# Altium project 28335_BASIC.PrjPcb
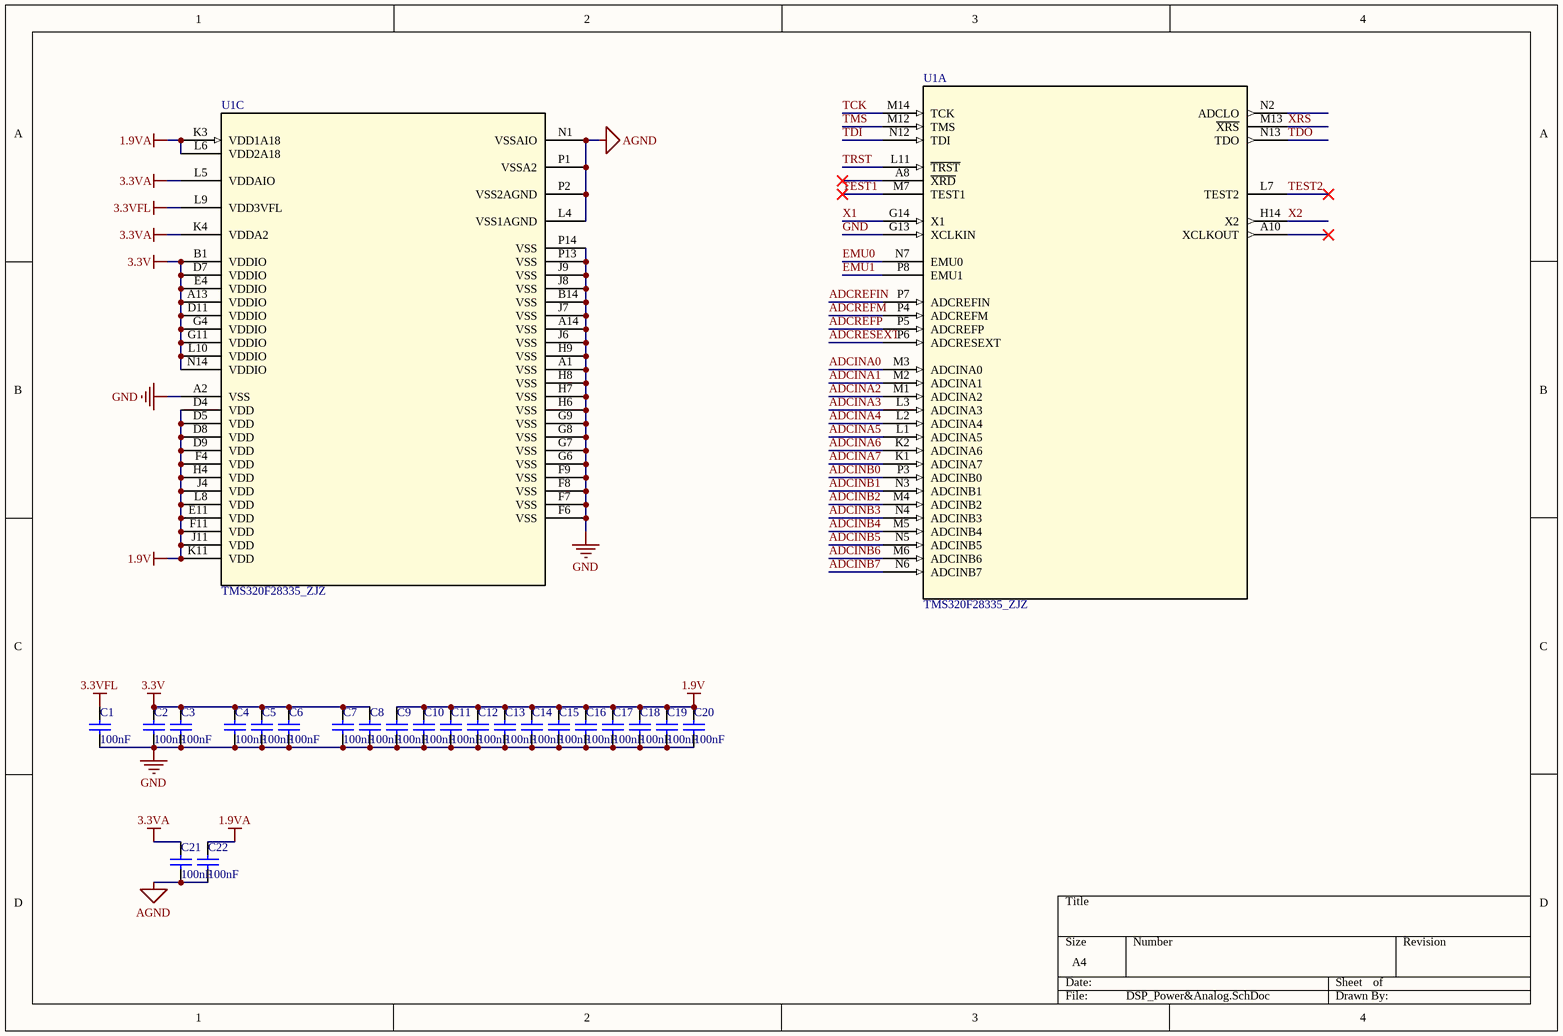
[diagram p0: DSP_Power&Analog.SchDoc]
3 sheets, 73 parts. Net scope: global (net labels, ports and power ports of the same name join across sheets).
Board file: PCB.PcbDoc
Sheets:
  DSP_Power&Analog.SchDoc
  DSP_GPIO&Digital.SchDoc
  DSP_Header.SchDoc

## Sheet DSP_Power&Analog.SchDoc
size A4

### Parts
C1  value 100nF  [C0402]  (hidden comment: Cap)
C2  value 100nF  [C0402]  (hidden comment: Cap)
C3  value 100nF  [C0402]  (hidden comment: Cap)
C4  value 100nF  [C0402]  (hidden comment: Cap)
C5  value 100nF  [C0402]  (hidden comment: Cap)
C6  value 100nF  [C0402]  (hidden comment: Cap)
C7  value 100nF  [C0603]  (hidden comment: Cap)
C8  value 100nF  [C0603]  (hidden comment: Cap)
C9  value 100nF  [C0402]  (hidden comment: Cap)
C10  value 100nF  [C0402]  (hidden comment: Cap)
C11  value 100nF  [C0402]  (hidden comment: Cap)
C12  value 100nF  [C0402]  (hidden comment: Cap)
C13  value 100nF  [C0402]  (hidden comment: Cap)
C14  value 100nF  [C0402]  (hidden comment: Cap)
C15  value 100nF  [C0402]  (hidden comment: Cap)
C16  value 100nF  [C0402]  (hidden comment: Cap)
C17  value 100nF  [C0402]  (hidden comment: Cap)
C18  value 100nF  [C0402]  (hidden comment: Cap)
C19  value 100nF  [C0402]  (hidden comment: Cap)
C20  value 100nF  [C0402]  (hidden comment: Cap)
C21  value 100nF  [C0402]  (hidden comment: Cap)
C22  value 100nF  [C0402]  (hidden comment: Cap)
U1  TMS320F28335_ZJZ  [ZJZ176]  (parts A,C of 3)

### Nets
1.9V: C9.1 C10.1 C11.1 C12.1 C13.1 C14.1 C15.1 C16.1 C17.1 C18.1 C19.1 C20.1 U1.D4(VDD) U1.D5(VDD) U1.D8(VDD) U1.D9(VDD) U1.E11(VDD) U1.F4(VDD) U1.F11(VDD) U1.H4(VDD) U1.J4(VDD) U1.J11(VDD) U1.K11(VDD) U1.L8(VDD)
1.9VA: C22.1 U1.K3(VDD1A18) U1.L6(VDD2A18)
3.3V: C2.1 C3.1 C4.1 C5.1 C6.1 C7.1 C8.1 U1.A13(VDDIO) U1.B1(VDDIO) U1.D7(VDDIO) U1.D11(VDDIO) U1.E4(VDDIO) U1.G4(VDDIO) U1.G11(VDDIO) U1.L10(VDDIO) U1.N14(VDDIO)
3.3VA: C21.1 U1.K4(VDDA2) U1.L5(VDDAIO)
3.3VFL: C1.1 U1.L9(VDD3VFL)
AGND: C21.2 C22.2 U1.L4(VSS1AGND) U1.N1(VSSAIO) U1.P1(VSSA2) U1.P2(VSS2AGND)
GND: C1.2 C2.2 C3.2 C4.2 C5.2 C6.2 C7.2 C8.2 C9.2 C10.2 C11.2 C12.2 C13.2 C14.2 C15.2 C16.2 C17.2 C18.2 C19.2 C20.2 U1.A1(VSS) U1.A2(VSS) U1.A14(VSS) U1.B14(VSS) U1.F6(VSS) U1.F7(VSS) U1.F8(VSS) U1.F9(VSS) U1.G6(VSS) U1.G7(VSS) U1.G8(VSS) U1.G9(VSS) U1.G13(XCLKIN) U1.H6(VSS) U1.H7(VSS) U1.H8(VSS) U1.H9(VSS) U1.J6(VSS) U1.J7(VSS) U1.J8(VSS) U1.J9(VSS) U1.P13(VSS) U1.P14(VSS)
ADCINA0: U1.M3(ADCINA0)
ADCINA1: U1.M2(ADCINA1)
ADCINA2: U1.M1(ADCINA2)
ADCINA3: U1.L3(ADCINA3)
ADCINA4: U1.L2(ADCINA4)
ADCINA5: U1.L1(ADCINA5)
ADCINA6: U1.K2(ADCINA6)
ADCINA7: U1.K1(ADCINA7)
ADCINB0: U1.P3(ADCINB0)
ADCINB1: U1.N3(ADCINB1)
ADCINB2: U1.M4(ADCINB2)
ADCINB3: U1.N4(ADCINB3)
ADCINB4: U1.M5(ADCINB4)
ADCINB5: U1.N5(ADCINB5)
ADCINB6: U1.M6(ADCINB6)
ADCINB7: U1.N6(ADCINB7)
ADCREFIN: U1.P7(ADCREFIN)
ADCREFM: U1.P4(ADCREFM)
ADCREFP: U1.P5(ADCREFP)
ADCRESEXT: U1.P6(ADCRESEXT)
EMU0: U1.N7(EMU0)
EMU1: U1.P8(EMU1)
TCK: U1.M14(TCK)
TDI: U1.N12(TDI)
TDO: U1.N13(TDO)
TEST1: U1.M7(TEST1)
TEST2: U1.L7(TEST2)
TMS: U1.M12(TMS)
TRST: U1.L11(~{TRST})
X1: U1.G14(X1)
X2: U1.H14(X2)
XRS: U1.M13(~{XRS})

Not connected (* = marked no-connect by the designer): U1 A8(~{XRD})* A10(XCLKOUT)* N2(ADCLO)

### Library data of the parts
C1-C22 = Cap: Capacitor; Published: 8-Jun-2000; LatestRevisionDate: 17-Jul-2002; LatestRevisionNote: Re-released for DXP Platform.; PackageReference: RAD-0.3; Publisher: Altium Limited; PackageDescription: Radial Cap, Thru-Hole; 2 Leads; 0.3 in Pin Spacing
U1 = TMS320F28335_ZJZ: Imported; Manufacturer: Texas Instruments; Manufacturer_Part_Number: tms320f28335_zjz_176; INDUSTRY_STD_PKG_TYPE: BGA; FAMILY_NAME: 28X DELFINO&#153; FLOATING-POINT SERIES; PIN_COUNT: 176; PACKAGE_DESIGNATOR: ZJZ; Vendor: Texas Instuments; Datasheet_URL: http://www.ti.com/lit/gpn/TMS320F28335; GENERIC_PART_NUMBER: TMS320F28335; Value: Value; Type: Type; RefDes: RefDes

## Sheet DSP_GPIO&Digital.SchDoc
size A4
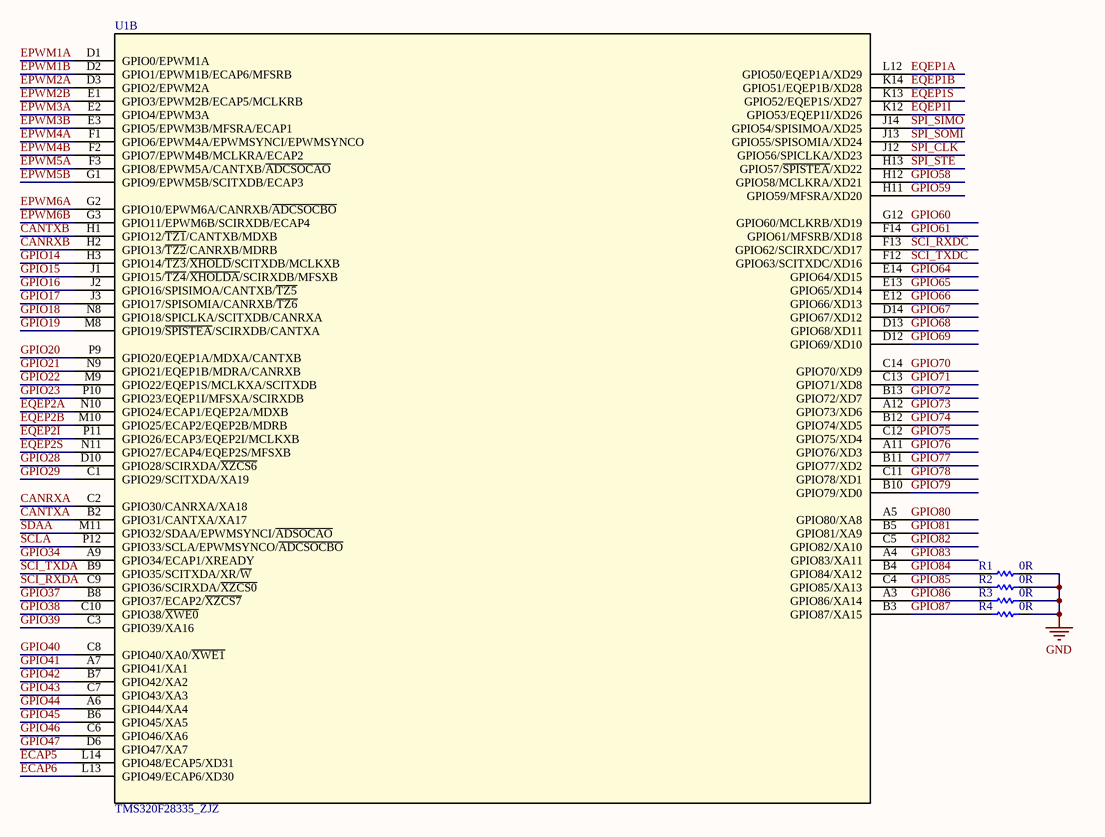
[diagram p1: DSP_GPIO&Digital.SchDoc]

### Parts
R1  value 0R  [r0603]  (hidden comment: Res1)
R2  value 0R  [r0603]  (hidden comment: Res1)
R3  value 0R  [r0603]  (hidden comment: Res1)
R4  value 0R  [r0603]  (hidden comment: Res1)
U1  TMS320F28335_ZJZ  [ZJZ176]  (part B of 3)

### Nets
GND: R1.1 R2.1 R3.1 R4.1
CANRXA: U1.C2(GPIO30/CANRXA/XA18)
CANRXB: U1.H2(GPIO13/~{TZ2}/CANRXB/MDRB)
CANTXA: U1.B2(GPIO31/CANTXA/XA17)
CANTXB: U1.H1(GPIO12/~{TZ1}/CANTXB/MDXB)
ECAP5: U1.L14(GPIO48/ECAP5/XD31)
ECAP6: U1.L13(GPIO49/ECAP6/XD30)
EPWM1A: U1.D1(GPIO0/EPWM1A)
EPWM1B: U1.D2(GPIO1/EPWM1B/ECAP6/MFSRB)
EPWM2A: U1.D3(GPIO2/EPWM2A)
EPWM2B: U1.E1(GPIO3/EPWM2B/ECAP5/MCLKRB)
EPWM3A: U1.E2(GPIO4/EPWM3A)
EPWM3B: U1.E3(GPIO5/EPWM3B/MFSRA/ECAP1)
EPWM4A: U1.F1(GPIO6/EPWM4A/EPWMSYNCI/EPWMSYNCO)
EPWM4B: U1.F2(GPIO7/EPWM4B/MCLKRA/ECAP2)
EPWM5A: U1.F3(GPIO8/EPWM5A/CANTXB/~{ADCSOCAO})
EPWM5B: U1.G1(GPIO9/EPWM5B/SCITXDB/ECAP3)
EPWM6A: U1.G2(GPIO10/EPWM6A/CANRXB/~{ADCSOCBO})
EPWM6B: U1.G3(GPIO11/EPWM6B/SCIRXDB/ECAP4)
EQEP1A: U1.L12(GPIO50/EQEP1A/XD29)
EQEP1B: U1.K14(GPIO51/EQEP1B/XD28)
EQEP1I: U1.K12(GPIO53/EQEP1I/XD26)
EQEP1S: U1.K13(GPIO52/EQEP1S/XD27)
EQEP2A: U1.N10(GPIO24/ECAP1/EQEP2A/MDXB)
EQEP2B: U1.M10(GPIO25/ECAP2/EQEP2B/MDRB)
EQEP2I: U1.P11(GPIO26/ECAP3/EQEP2I/MCLKXB)
EQEP2S: U1.N11(GPIO27/ECAP4/EQEP2S/MFSXB)
GPIO14: U1.H3(GPIO14/~{TZ3}/~{XHOLD}/SCITXDB/MCLKXB)
GPIO15: U1.J1(GPIO15/~{TZ4}/~{XHOLDA}/SCIRXDB/MFSXB)
GPIO16: U1.J2(GPIO16/SPISIMOA/CANTXB/~{TZ5})
GPIO17: U1.J3(GPIO17/SPISOMIA/CANRXB/~{TZ6})
GPIO18: U1.N8(GPIO18/SPICLKA/SCITXDB/CANRXA)
GPIO19: U1.M8(GPIO19/~{SPISTEA}/SCIRXDB/CANTXA)
GPIO20: U1.P9(GPIO20/EQEP1A/MDXA/CANTXB)
GPIO21: U1.N9(GPIO21/EQEP1B/MDRA/CANRXB)
GPIO22: U1.M9(GPIO22/EQEP1S/MCLKXA/SCITXDB)
GPIO23: U1.P10(GPIO23/EQEP1I/MFSXA/SCIRXDB)
GPIO28: U1.D10(GPIO28/SCIRXDA/~{XZCS6})
GPIO29: U1.C1(GPIO29/SCITXDA/XA19)
GPIO34: U1.A9(GPIO34/ECAP1/XREADY)
GPIO37: U1.B8(GPIO37/ECAP2/~{XZCS7})
GPIO38: U1.C10(GPIO38/~{XWE0})
GPIO39: U1.C3(GPIO39/XA16)
GPIO40: U1.C8(GPIO40/XA0/~{XWE1})
GPIO41: U1.A7(GPIO41/XA1)
GPIO42: U1.B7(GPIO42/XA2)
GPIO43: U1.C7(GPIO43/XA3)
GPIO44: U1.A6(GPIO44/XA4)
GPIO45: U1.B6(GPIO45/XA5)
GPIO46: U1.C6(GPIO46/XA6)
GPIO47: U1.D6(GPIO47/XA7)
GPIO58: U1.H12(GPIO58/MCLKRA/XD21)
GPIO59: U1.H11(GPIO59/MFSRA/XD20)
GPIO60: U1.G12(GPIO60/MCLKRB/XD19)
GPIO61: U1.F14(GPIO61/MFSRB/XD18)
GPIO64: U1.E14(GPIO64/XD15)
GPIO65: U1.E13(GPIO65/XD14)
GPIO66: U1.E12(GPIO66/XD13)
GPIO67: U1.D14(GPIO67/XD12)
GPIO68: U1.D13(GPIO68/XD11)
GPIO69: U1.D12(GPIO69/XD10)
GPIO70: U1.C14(GPIO70/XD9)
GPIO71: U1.C13(GPIO71/XD8)
GPIO72: U1.B13(GPIO72/XD7)
GPIO73: U1.A12(GPIO73/XD6)
GPIO74: U1.B12(GPIO74/XD5)
GPIO75: U1.C12(GPIO75/XD4)
GPIO76: U1.A11(GPIO76/XD3)
GPIO77: U1.B11(GPIO77/XD2)
GPIO78: U1.C11(GPIO78/XD1)
GPIO79: U1.B10(GPIO79/XD0)
GPIO80: U1.A5(GPIO80/XA8)
GPIO81: U1.B5(GPIO81/XA9)
GPIO82: U1.C5(GPIO82/XA10)
GPIO83: U1.A4(GPIO83/XA11)
GPIO84: R1.2 U1.B4(GPIO84/XA12)
GPIO85: R2.2 U1.C4(GPIO85/XA13)
GPIO86: R3.2 U1.A3(GPIO86/XA14)
GPIO87: R4.2 U1.B3(GPIO87/XA15)
SCI_RXDA: U1.C9(GPIO36/SCIRXDA/~{XZCS0})
SCI_RXDC: U1.F13(GPIO62/SCIRXDC/XD17)
SCI_TXDA: U1.B9(GPIO35/SCITXDA/XR/~{W})
SCI_TXDC: U1.F12(GPIO63/SCITXDC/XD16)
SCLA: U1.P12(GPIO33/SCLA/EPWMSYNCO/~{ADCSOCBO})
SDAA: U1.M11(GPIO32/SDAA/EPWMSYNCI/~{ADSOCAO})
SPI_CLK: U1.J12(GPIO56/SPICLKA/XD23)
SPI_SIMO: U1.J14(GPIO54/SPISIMOA/XD25)
SPI_SOMI: U1.J13(GPIO55/SPISOMIA/XD24)
SPI_STE: U1.H13(GPIO57/~{SPISTEA}/XD22)

### Library data of the parts
R1-R4 = Res1: Resistor; Published: 8-Jun-2000; LatestRevisionDate: 17-Jul-2002; LatestRevisionNote: Re-released for DXP Platform.; PackageReference: AXIAL-0.3; Publisher: Altium Limited; PackageDescription: Axial Device, Thru-Hole; 2 Leads; 0.3 in Pin Spacing
U1 = TMS320F28335_ZJZ: as U1 on sheet DSP_Power&Analog; Datasheet_URL: http://www.ti.com/lit/gpn/TMS320F28335; GENERIC_PART_NUMBER: TMS320F28335; Value: Value; Type: Type; RefDes: RefDes

## Sheet DSP_Header.SchDoc
size A4
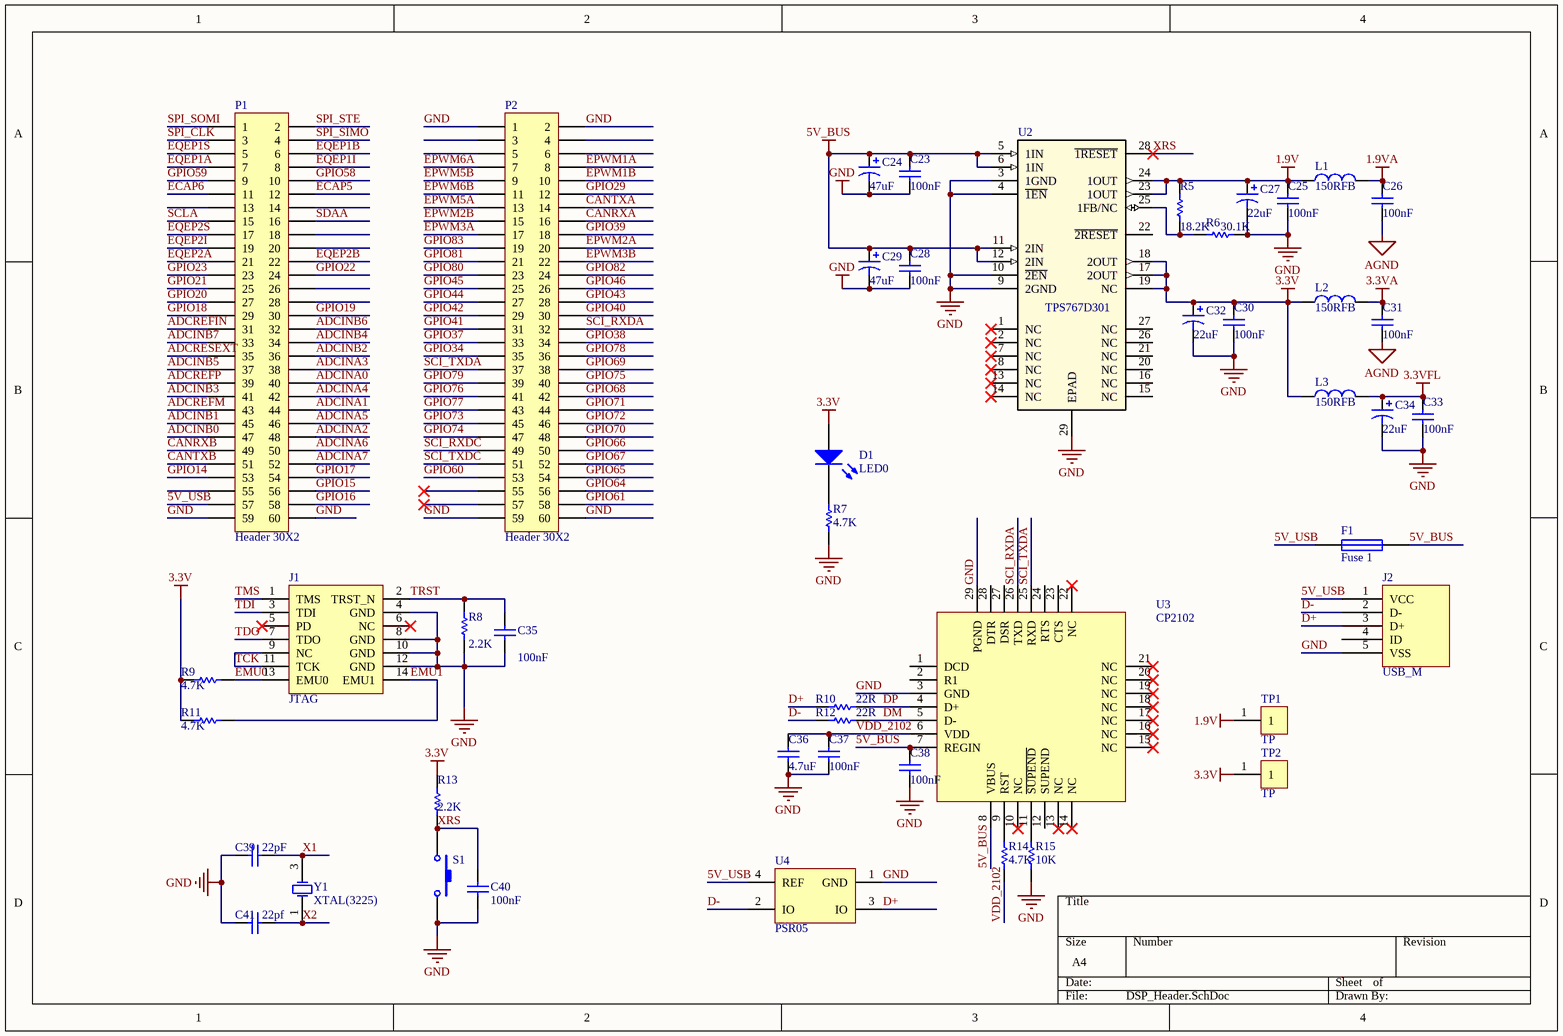
[diagram p2: DSP_Header.SchDoc]

### Parts
C23  value 100nF  [C0603]  (hidden comment: Cap)
C24  value 47uF  [C0805]  (hidden comment: Cap Pol3)
C25  value 100nF  [C0603]  (hidden comment: Cap)
C26  value 100nF  [C0603]  (hidden comment: Cap)
C27  value 22uF  [C0805]  (hidden comment: Cap Pol3)
C28  value 100nF  [C0603]  (hidden comment: Cap)
C29  value 47uF  [C0805]  (hidden comment: Cap Pol3)
C30  value 100nF  [C0603]  (hidden comment: Cap)
C31  value 100nF  [C0603]  (hidden comment: Cap)
C32  value 22uF  [C0805]  (hidden comment: Cap Pol3)
C33  value 100nF  [C0603]  (hidden comment: Cap)
C34  value 22uF  [C0805]  (hidden comment: Cap Pol3)
C35  value 100nF  [C0603]  (hidden comment: Cap)
C36  value 4.7uF  [C0603]  (hidden comment: Cap)
C37  value 100nF  [C0603]  (hidden comment: Cap)
C38  value 100nF  [C0603]  (hidden comment: Cap)
C39  value 22pF  [C0603]  (hidden comment: Cap)
C40  value 100nF  [C0603]  (hidden comment: Cap)
C41  value 22pf  [C0603]  (hidden comment: Cap)
D1  LED0  [0603D]
F1  Fuse 1  [0805R]
J1  JTAG  [HDR2X7]
J2  USB_M  [USB_MICRO_DIP]
L1  value 150RFB  [r0603]  (hidden comment: Inductors)
L2  value 150RFB  [r0603]  (hidden comment: Inductors)
L3  value 150RFB  [r0603]  (hidden comment: Inductors)
P1  Header 30X2  [0.8BTB_60P]
P2  Header 30X2  [0.8BTB_60P]
R5  value 18.2K  [r0603]  (hidden comment: Res1)
R6  value 30.1K  [r0603]  (hidden comment: Res1)
R7  value 4.7K  [R0603]  (hidden comment: Res1)
R8  value 2.2K  [r0603]  (hidden comment: Res1)
R9  value 4.7K  [R0603]  (hidden comment: Res1)
R10  value 22R  [R0603]  (hidden comment: Res1)
R11  value 4.7K  [r0603]  (hidden comment: Res1)
R12  value 22R  [R0603]  (hidden comment: Res1)
R13  value 2.2K  [r0603]  (hidden comment: Res1)
R14  value 4.7K  [R0603]  (hidden comment: Res1)
R15  value 10K  [R0603]  (hidden comment: Res1)
S1  SW-PB  [SW_3*6]  (value not drawn)
TP1  TP  [TPJ1.0]
TP2  TP  [TPJ1.0]
U2  TPS767D301  [PWP28_6P46X2P4]
U3  CP2102  [QFN28]
U4  PSR05  [SOT143]
Y1  XTAL(3225)  [Y3225]

### Nets
1.9V: C25.2 C27.1 L1.1 R5.2 TP1.1 U2.23(1OUT) U2.24(1OUT)
1.9VA: C26.2 L1.2
3.3V: C30.2 C32.1 D1.1(A) L2.1 L3.1 R9.2 R11.2 R13.2 TP2.1 U2.17(2OUT) U2.18(2OUT) U2.19(NC)
3.3VA: C31.2 L2.2
3.3VFL: C33.2 C34.1 L3.2
5V_BUS: C23.2 C24.1 C28.2 C29.1 C38.2 F1.2 U2.5(1IN) U2.6(1IN) U2.11(2IN) U2.12(2IN) U3.7(REGIN) U3.8(VBUS)
AGND: C26.1 C31.1
GND: C23.1 C24.2 C25.1 C27.2 C28.1 C29.2 C30.1 C32.2 C33.1 C34.2 C35.1 C36.1 C37.1 C38.1 C39.2 C40.2 C41.2 J1.4(GND) J1.8(GND) J1.10(GND) J1.12(GND) J2.5(VSS) P1.59 P1.60 P2.1 P2.2 P2.59 P2.60 R6.1 R7.2 R8.1 R15.2 S1.2 U2.3(1GND) U2.4(~{1EN}) U2.9(2GND) U2.10(~{2EN}) U2.29(EPAD) U3.3(GND) U3.29(PGND) U4.1(GND)
5V_USB: F1.1 J2.1(VCC) P1.57 U4.4(REF)
ADCINA0: P1.40
ADCINA1: P1.44
ADCINA2: P1.48
ADCINA3: P1.38
ADCINA4: P1.42
ADCINA5: P1.46
ADCINA6: P1.50
ADCINA7: P1.52
ADCINB0: P1.47
ADCINB1: P1.45
ADCINB2: P1.36
ADCINB3: P1.41
ADCINB4: P1.34
ADCINB5: P1.37
ADCINB6: P1.32
ADCINB7: P1.33
ADCREFIN: P1.31
ADCREFM: P1.43
ADCREFP: P1.39
ADCRESEXT: P1.35
CANRXA: P2.16
CANRXB: P1.49
CANTXA: P2.14
CANTXB: P1.51
D+: J2.3(D+) R10.2 U4.3(IO)
D-: J2.2(D-) R12.1 U4.2(IO)
DM: R12.2 U3.5(D-)
DP: R10.1 U3.4(D+)
ECAP5: P1.12
ECAP6: P1.11
EMU0: J1.13(EMU0) R9.1
EMU1: J1.14(EMU1) R11.1
EPWM1A: P2.8
EPWM1B: P2.10
EPWM2A: P2.20
EPWM2B: P2.15
EPWM3A: P2.17
EPWM3B: P2.22
EPWM5A: P2.13
EPWM5B: P2.9
EPWM6A: P2.7
EPWM6B: P2.11
EQEP1A: P1.7
EQEP1B: P1.6
EQEP1I: P1.8
EQEP1S: P1.5
EQEP2A: P1.21
EQEP2B: P1.22
EQEP2I: P1.19
EQEP2S: P1.17
GPIO14: P1.53
GPIO15: P1.56
GPIO16: P1.58
GPIO17: P1.54
GPIO18: P1.29
GPIO19: P1.30
GPIO20: P1.27
GPIO21: P1.25
GPIO22: P1.24
GPIO23: P1.23
GPIO29: P2.12
GPIO34: P2.35
GPIO37: P2.33
GPIO38: P2.34
GPIO39: P2.18
GPIO40: P2.30
GPIO41: P2.31
GPIO42: P2.29
GPIO43: P2.28
GPIO44: P2.27
GPIO45: P2.25
GPIO46: P2.26
GPIO58: P1.10
GPIO59: P1.9
GPIO60: P2.53
GPIO61: P2.58
GPIO64: P2.56
GPIO65: P2.54
GPIO66: P2.50
GPIO67: P2.52
GPIO68: P2.42
GPIO69: P2.38
GPIO70: P2.48
GPIO71: P2.44
GPIO72: P2.46
GPIO73: P2.45
GPIO74: P2.47
GPIO75: P2.40
GPIO76: P2.41
GPIO77: P2.43
GPIO78: P2.36
GPIO79: P2.39
GPIO80: P2.23
GPIO81: P2.21
GPIO82: P2.24
GPIO83: P2.19
SCI_RXDA: P2.32 U3.26(TXD)
SCI_RXDC: P2.49
SCI_TXDA: P2.37 U3.25(RXD)
SCI_TXDC: P2.51
SCLA: P1.15
SDAA: P1.16
SPI_CLK: P1.3
SPI_SIMO: P1.4
SPI_SOMI: P1.1
SPI_STE: P1.2
TCK: J1.9(NC) J1.11(TCK)
TDI: J1.3(TDI)
TDO: J1.7(TDO)
TMS: J1.1(TMS)
TRST: C35.2 J1.2(TRST_N) R8.2
VDD_2102: C36.2 C37.2 R14.2 U3.6(VDD)
X1: C39.1 Y1.3(OSC2)
X2: C41.1 Y1.1(OSC1)
XRS: C40.1 R13.1 S1.1 U2.28(~{1RESET})
NetD1_2: D1.2(K) R7.1
NetR5_1: R5.1 R6.2 U2.25(1FB/NC)
NetR14_1: R14.1 U3.9(RST)
NetR15_1: R15.1 U3.11(~{SUPEND})

Not connected (* = marked no-connect by the designer): J1 5(PD)* 6(NC)*; J2 4(ID); P1 13 14 18 20 26 28 55; P2 3 4 5 6 55* 57*; U2 1(NC)* 2(NC)* 7(NC)* 8(NC)* 13(NC)* 14(NC)* 15(NC) 16(NC) 20(NC) 21(NC) 22(~{2RESET}) 26(NC) 27(NC); U3 1(DCD) 2(R1) 10(NC)* 12(SUPEND) 13(NC)* 14(NC)* 15(NC)* 16(NC)* 17(NC)* 18(NC)* 19(NC)* 20(NC)* 21(NC)* 22(NC)* 23(CTS) 24(RTS) 27(DSR) 28(DTR)

### Library data of the parts
C23 C25 C26 C28 C30 C31 C33 C35-C41 = Cap: Capacitor; Published: 8-Jun-2000; LatestRevisionDate: 17-Jul-2002; LatestRevisionNote: Re-released for DXP Platform.; PackageReference: RAD-0.3; Publisher: Altium Limited; PackageDescription: Radial Cap, Thru-Hole; 2 Leads; 0.3 in Pin Spacing
C24 C27 C29 C32 C34 = Cap Pol3: Polarized Capacitor (Surface Mount); Published: 8-Jun-2000; LatestRevisionDate: 29-May-2009; LatestRevisionNote: IPC-7351 Footprint Added.; PackageReference: C0805; Publisher: Altium Limited; PackageDescription: Chip Capacitor
D1 = LED0: Typical INFRARED GaAs LED; Published: 8-Jun-2000; LatestRevisionDate: 08-Jul-2005; LatestRevisionNote: Mech Layer 1 removed.; PackageReference: LED-0; Publisher: Altium Limited
F1 = Fuse 1: Fuse; Published: 8-Jun-2000; LatestRevisionDate: 17-Jul-2002; LatestRevisionNote: Re-released for DXP Platform.; PackageReference: PIN-W2/E2.8; Publisher: Altium Limited; PackageDescription: Thru-Hole; 2 Leads
J2 = USB_M: MicroUSB接口
P1 P2 = Header 30X2: Header, 30-Pin, Dual row; LatestRevisionDate: 17-Jul-2002; LatestRevisionNote: Re-released for DXP Platform.; Publisher: Altium Limited
R5-R15 = Res1: Resistor; Published: 8-Jun-2000; LatestRevisionDate: 17-Jul-2002; LatestRevisionNote: Re-released for DXP Platform.; PackageReference: AXIAL-0.3; Publisher: Altium Limited
  R5 R6 R8 R9 R11 R13: PackageDescription: Axial Device, Thru-Hole; 2 Leads; 0.3 in Pin Spacing
S1 = SW-PB: Switch; Published: 24-Mar-1999; LatestRevisionDate: 17-Jul-2002; LatestRevisionNote: Re-released for DXP Platform.; PackageReference: SPST-2; Publisher: Altium Limited; PackageDescription: Switch; 2 Leads
U2 = TPS767D301: Imported; Manufacturer_Part_Number: tps767d301-ep_pwp_28; GENERIC_PART_NUMBER: TPS767D301-EP; Vendor: Texas Instruments; PACKAGE_DESIGNATOR: PWP; PIN_COUNT: 28; FAMILY_NAME: DUAL CHANNEL LDO; INDUSTRY_STD_PKG_TYPE: HTSSOP; Manufacturer: Texas Instruments; Datasheet_URL: http://www.ti.com/lit/gpn/TPS767D301-EP; Value: Value; Type: Type; RefDes: RefDes
Y1 = XTAL(3225): Crystal Oscillator; Published: 8-Jun-2000; LatestRevisionDate: 17-Jul-2002; LatestRevisionNote: Re-released for DXP Platform.; PackageReference: R38; Publisher: Altium Limited

## Nets that join several sheets
1.9V: DSP_Power&Analog (24 pins), DSP_Header (7 pins)
1.9VA: DSP_Power&Analog (C22.1 U1.K3 U1.L6), DSP_Header (C26.2 L1.2)
3.3V: DSP_Power&Analog (16 pins), DSP_Header (12 pins)
3.3VA: DSP_Power&Analog (C21.1 U1.K4 U1.L5), DSP_Header (C31.2 L2.2)
3.3VFL: DSP_Power&Analog (C1.1 U1.L9), DSP_Header (C33.2 C34.1 L3.2)
AGND: DSP_Power&Analog (6 pins), DSP_Header (C26.1 C31.1)
GND: DSP_Power&Analog (43 pins), DSP_GPIO&Digital (R1.1 R2.1 R3.1 R4.1), DSP_Header (41 pins)
ADCINA0: DSP_Power&Analog (U1.M3), DSP_Header (P1.40)
ADCINA1: DSP_Power&Analog (U1.M2), DSP_Header (P1.44)
ADCINA2: DSP_Power&Analog (U1.M1), DSP_Header (P1.48)
ADCINA3: DSP_Power&Analog (U1.L3), DSP_Header (P1.38)
ADCINA4: DSP_Power&Analog (U1.L2), DSP_Header (P1.42)
ADCINA5: DSP_Power&Analog (U1.L1), DSP_Header (P1.46)
ADCINA6: DSP_Power&Analog (U1.K2), DSP_Header (P1.50)
ADCINA7: DSP_Power&Analog (U1.K1), DSP_Header (P1.52)
ADCINB0: DSP_Power&Analog (U1.P3), DSP_Header (P1.47)
ADCINB1: DSP_Power&Analog (U1.N3), DSP_Header (P1.45)
ADCINB2: DSP_Power&Analog (U1.M4), DSP_Header (P1.36)
ADCINB3: DSP_Power&Analog (U1.N4), DSP_Header (P1.41)
ADCINB4: DSP_Power&Analog (U1.M5), DSP_Header (P1.34)
ADCINB5: DSP_Power&Analog (U1.N5), DSP_Header (P1.37)
ADCINB6: DSP_Power&Analog (U1.M6), DSP_Header (P1.32)
ADCINB7: DSP_Power&Analog (U1.N6), DSP_Header (P1.33)
ADCREFIN: DSP_Power&Analog (U1.P7), DSP_Header (P1.31)
ADCREFM: DSP_Power&Analog (U1.P4), DSP_Header (P1.43)
ADCREFP: DSP_Power&Analog (U1.P5), DSP_Header (P1.39)
ADCRESEXT: DSP_Power&Analog (U1.P6), DSP_Header (P1.35)
CANRXA: DSP_GPIO&Digital (U1.C2), DSP_Header (P2.16)
CANRXB: DSP_GPIO&Digital (U1.H2), DSP_Header (P1.49)
CANTXA: DSP_GPIO&Digital (U1.B2), DSP_Header (P2.14)
CANTXB: DSP_GPIO&Digital (U1.H1), DSP_Header (P1.51)
ECAP5: DSP_GPIO&Digital (U1.L14), DSP_Header (P1.12)
ECAP6: DSP_GPIO&Digital (U1.L13), DSP_Header (P1.11)
EMU0: DSP_Power&Analog (U1.N7), DSP_Header (J1.13 R9.1)
EMU1: DSP_Power&Analog (U1.P8), DSP_Header (J1.14 R11.1)
EPWM1A: DSP_GPIO&Digital (U1.D1), DSP_Header (P2.8)
EPWM1B: DSP_GPIO&Digital (U1.D2), DSP_Header (P2.10)
EPWM2A: DSP_GPIO&Digital (U1.D3), DSP_Header (P2.20)
EPWM2B: DSP_GPIO&Digital (U1.E1), DSP_Header (P2.15)
EPWM3A: DSP_GPIO&Digital (U1.E2), DSP_Header (P2.17)
EPWM3B: DSP_GPIO&Digital (U1.E3), DSP_Header (P2.22)
EPWM5A: DSP_GPIO&Digital (U1.F3), DSP_Header (P2.13)
EPWM5B: DSP_GPIO&Digital (U1.G1), DSP_Header (P2.9)
EPWM6A: DSP_GPIO&Digital (U1.G2), DSP_Header (P2.7)
EPWM6B: DSP_GPIO&Digital (U1.G3), DSP_Header (P2.11)
EQEP1A: DSP_GPIO&Digital (U1.L12), DSP_Header (P1.7)
EQEP1B: DSP_GPIO&Digital (U1.K14), DSP_Header (P1.6)
EQEP1I: DSP_GPIO&Digital (U1.K12), DSP_Header (P1.8)
EQEP1S: DSP_GPIO&Digital (U1.K13), DSP_Header (P1.5)
EQEP2A: DSP_GPIO&Digital (U1.N10), DSP_Header (P1.21)
EQEP2B: DSP_GPIO&Digital (U1.M10), DSP_Header (P1.22)
EQEP2I: DSP_GPIO&Digital (U1.P11), DSP_Header (P1.19)
EQEP2S: DSP_GPIO&Digital (U1.N11), DSP_Header (P1.17)
GPIO14: DSP_GPIO&Digital (U1.H3), DSP_Header (P1.53)
GPIO15: DSP_GPIO&Digital (U1.J1), DSP_Header (P1.56)
GPIO16: DSP_GPIO&Digital (U1.J2), DSP_Header (P1.58)
GPIO17: DSP_GPIO&Digital (U1.J3), DSP_Header (P1.54)
GPIO18: DSP_GPIO&Digital (U1.N8), DSP_Header (P1.29)
GPIO19: DSP_GPIO&Digital (U1.M8), DSP_Header (P1.30)
GPIO20: DSP_GPIO&Digital (U1.P9), DSP_Header (P1.27)
GPIO21: DSP_GPIO&Digital (U1.N9), DSP_Header (P1.25)
GPIO22: DSP_GPIO&Digital (U1.M9), DSP_Header (P1.24)
GPIO23: DSP_GPIO&Digital (U1.P10), DSP_Header (P1.23)
GPIO29: DSP_GPIO&Digital (U1.C1), DSP_Header (P2.12)
GPIO34: DSP_GPIO&Digital (U1.A9), DSP_Header (P2.35)
GPIO37: DSP_GPIO&Digital (U1.B8), DSP_Header (P2.33)
GPIO38: DSP_GPIO&Digital (U1.C10), DSP_Header (P2.34)
GPIO39: DSP_GPIO&Digital (U1.C3), DSP_Header (P2.18)
GPIO40: DSP_GPIO&Digital (U1.C8), DSP_Header (P2.30)
GPIO41: DSP_GPIO&Digital (U1.A7), DSP_Header (P2.31)
GPIO42: DSP_GPIO&Digital (U1.B7), DSP_Header (P2.29)
GPIO43: DSP_GPIO&Digital (U1.C7), DSP_Header (P2.28)
GPIO44: DSP_GPIO&Digital (U1.A6), DSP_Header (P2.27)
GPIO45: DSP_GPIO&Digital (U1.B6), DSP_Header (P2.25)
GPIO46: DSP_GPIO&Digital (U1.C6), DSP_Header (P2.26)
GPIO58: DSP_GPIO&Digital (U1.H12), DSP_Header (P1.10)
GPIO59: DSP_GPIO&Digital (U1.H11), DSP_Header (P1.9)
GPIO60: DSP_GPIO&Digital (U1.G12), DSP_Header (P2.53)
GPIO61: DSP_GPIO&Digital (U1.F14), DSP_Header (P2.58)
GPIO64: DSP_GPIO&Digital (U1.E14), DSP_Header (P2.56)
GPIO65: DSP_GPIO&Digital (U1.E13), DSP_Header (P2.54)
GPIO66: DSP_GPIO&Digital (U1.E12), DSP_Header (P2.50)
GPIO67: DSP_GPIO&Digital (U1.D14), DSP_Header (P2.52)
GPIO68: DSP_GPIO&Digital (U1.D13), DSP_Header (P2.42)
GPIO69: DSP_GPIO&Digital (U1.D12), DSP_Header (P2.38)
GPIO70: DSP_GPIO&Digital (U1.C14), DSP_Header (P2.48)
GPIO71: DSP_GPIO&Digital (U1.C13), DSP_Header (P2.44)
GPIO72: DSP_GPIO&Digital (U1.B13), DSP_Header (P2.46)
GPIO73: DSP_GPIO&Digital (U1.A12), DSP_Header (P2.45)
GPIO74: DSP_GPIO&Digital (U1.B12), DSP_Header (P2.47)
GPIO75: DSP_GPIO&Digital (U1.C12), DSP_Header (P2.40)
GPIO76: DSP_GPIO&Digital (U1.A11), DSP_Header (P2.41)
GPIO77: DSP_GPIO&Digital (U1.B11), DSP_Header (P2.43)
GPIO78: DSP_GPIO&Digital (U1.C11), DSP_Header (P2.36)
GPIO79: DSP_GPIO&Digital (U1.B10), DSP_Header (P2.39)
GPIO80: DSP_GPIO&Digital (U1.A5), DSP_Header (P2.23)
GPIO81: DSP_GPIO&Digital (U1.B5), DSP_Header (P2.21)
GPIO82: DSP_GPIO&Digital (U1.C5), DSP_Header (P2.24)
GPIO83: DSP_GPIO&Digital (U1.A4), DSP_Header (P2.19)
SCI_RXDA: DSP_GPIO&Digital (U1.C9), DSP_Header (P2.32 U3.26)
SCI_RXDC: DSP_GPIO&Digital (U1.F13), DSP_Header (P2.49)
SCI_TXDA: DSP_GPIO&Digital (U1.B9), DSP_Header (P2.37 U3.25)
SCI_TXDC: DSP_GPIO&Digital (U1.F12), DSP_Header (P2.51)
SCLA: DSP_GPIO&Digital (U1.P12), DSP_Header (P1.15)
SDAA: DSP_GPIO&Digital (U1.M11), DSP_Header (P1.16)
SPI_CLK: DSP_GPIO&Digital (U1.J12), DSP_Header (P1.3)
SPI_SIMO: DSP_GPIO&Digital (U1.J14), DSP_Header (P1.4)
SPI_SOMI: DSP_GPIO&Digital (U1.J13), DSP_Header (P1.1)
SPI_STE: DSP_GPIO&Digital (U1.H13), DSP_Header (P1.2)
TCK: DSP_Power&Analog (U1.M14), DSP_Header (J1.9 J1.11)
TDI: DSP_Power&Analog (U1.N12), DSP_Header (J1.3)
TDO: DSP_Power&Analog (U1.N13), DSP_Header (J1.7)
TMS: DSP_Power&Analog (U1.M12), DSP_Header (J1.1)
TRST: DSP_Power&Analog (U1.L11), DSP_Header (C35.2 J1.2 R8.2)
X1: DSP_Power&Analog (U1.G14), DSP_Header (C39.1 Y1.3)
X2: DSP_Power&Analog (U1.H14), DSP_Header (C41.1 Y1.1)
XRS: DSP_Power&Analog (U1.M13), DSP_Header (C40.1 R13.1 S1.1 U2.28)